# EAGLE design 50_Shot_CPU_V0.0 (EAGLE 7.7.0)
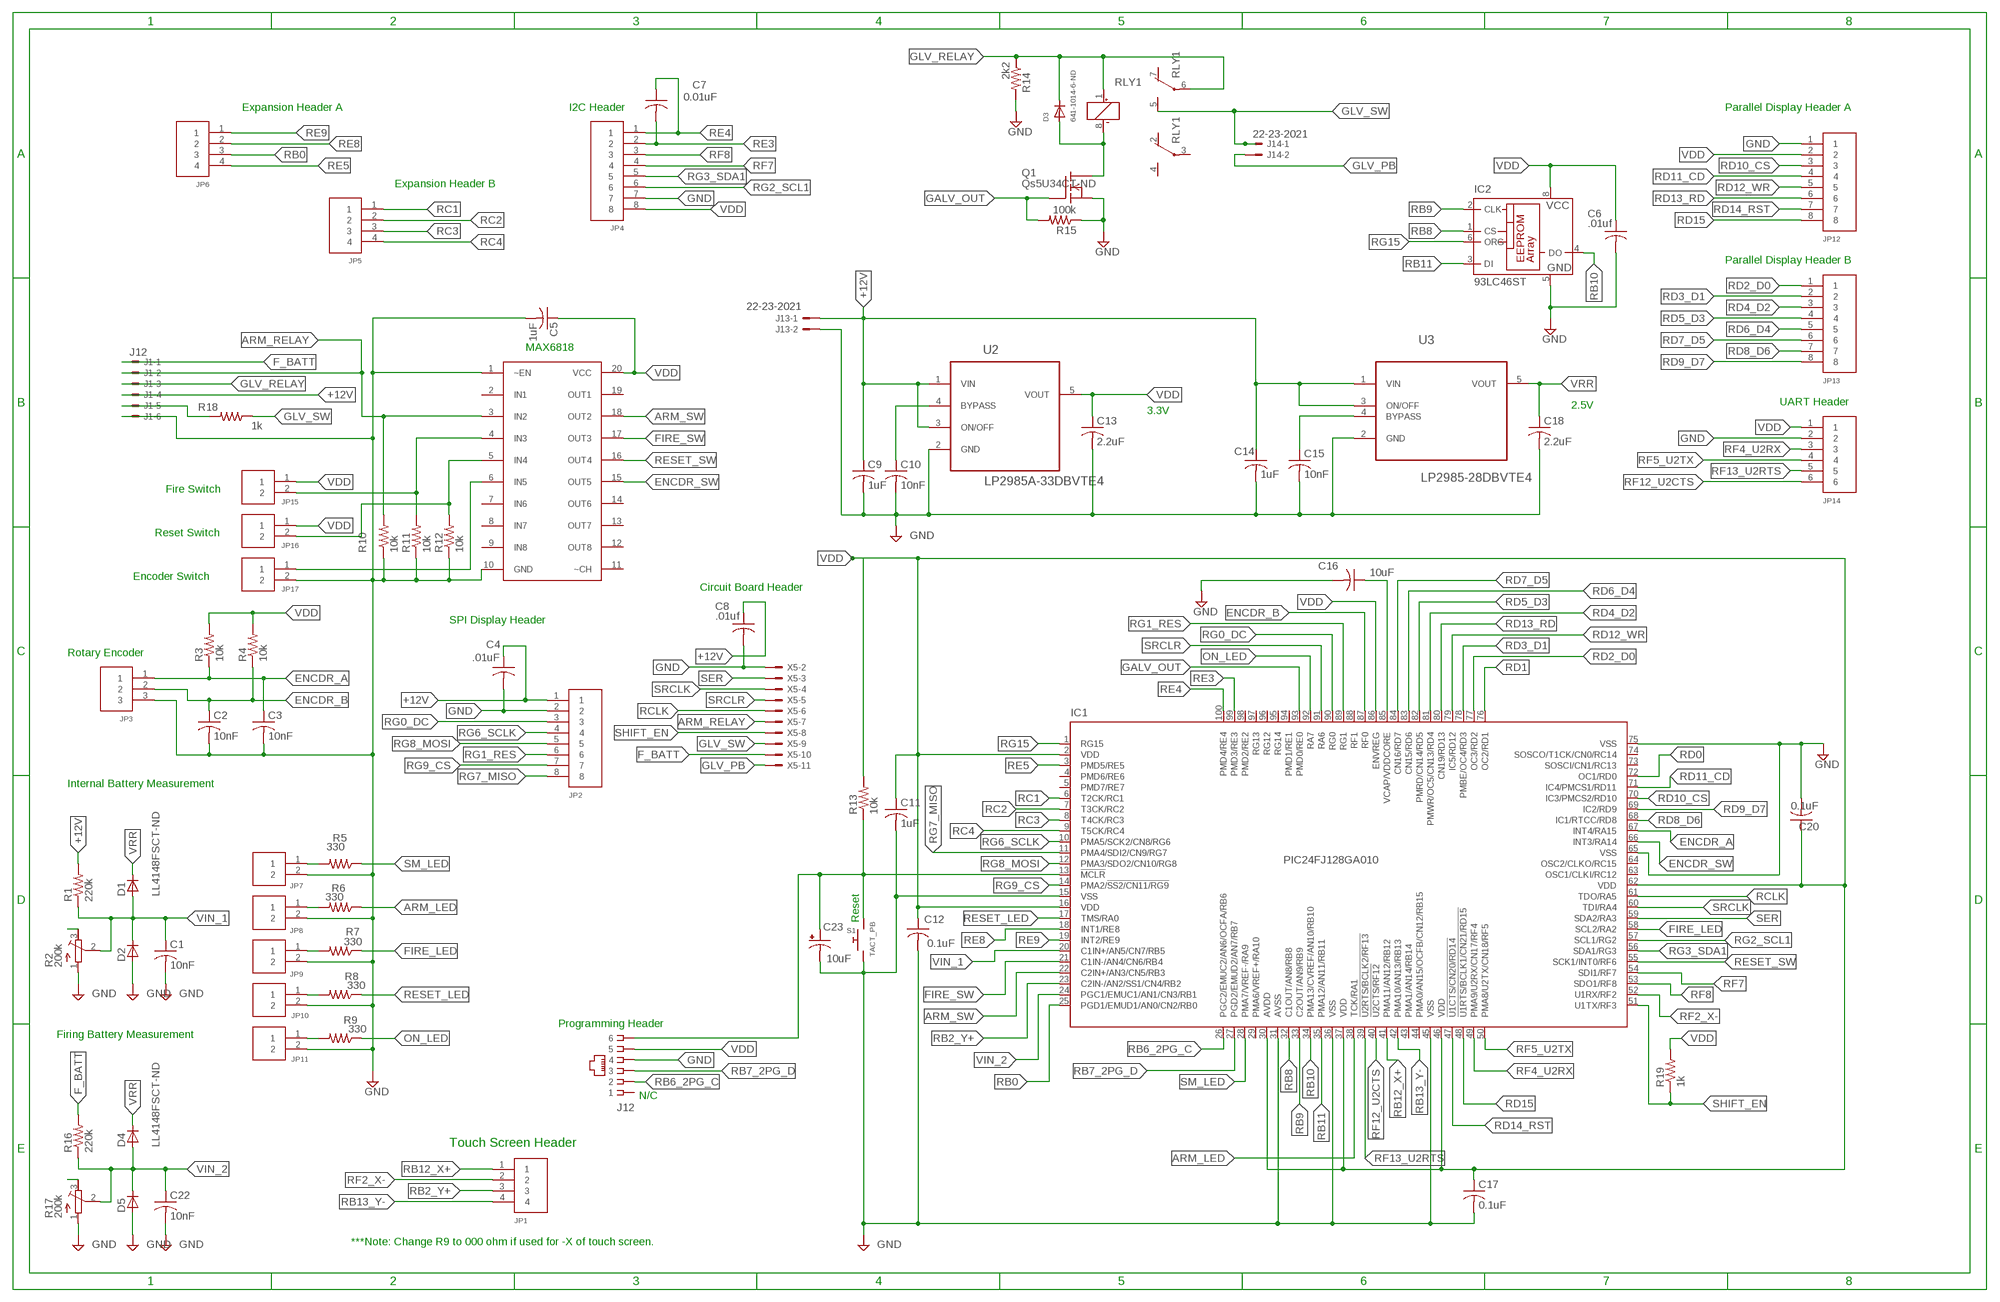
[diagram p0: schematic, sheet 1]

## Parts
C1  10nF  C-USC0805  [C0805]
C2  10nF  C-USC0805  [C0805]
C3  10nF  C-USC0805  [C0805]
C4  .01uF  C-USC0805  [C0805]
C5  1uF  C-USC0805  [C0805]
C6  .01uf  C-USC0805  [C0805]
C7  0.01uF  C-USC0805  [C0805]
C8  .01uf  C-USC0805  [C0805]
C9  1uF  C-USC0805  [C0805]
C10  10nF  C-USC0805  [C0805]
C11  1uF  C-USC0805  [C0805]
C12  0.1uF  C-USC0805  [C0805]
C13  2.2uF  C-USC0805  [C0805]
C14  1uF  C-USC0805  [C0805]
C15  10nF  C-USC0805  [C0805]
C16  10uF  C-USC0805  [C0805]
C17  0.1uF  C-USC0805  [C0805]
C18  2.2uF  C-USC0805  [C0805]
C20  0.1uF  C-USC0805  [C0805]
C22  10nF  C-USC0805  [C0805]
C23  10uF  CAP3X3  [CAP3X3]
D1  LL4148FSCT-ND  D-SOD-80  [SOD80]
D2  LL4148FSCT-ND  D-SOD-80  [SOD80]
D3  641-1014-6-ND  DIODESOD-123  [SOD-123]
D4  LL4148FSCT-ND  D-SOD-80  [SOD80]
D5  LL4148FSCT-ND  D-SOD-80  [SOD80]
IC1  PIC24FJ128GA010  [TQFP100-14X14]
IC2  93LC46ST  [TSSOP8]
J1  J12  22-23-2061  [22-23-2061]
J12  A311422_nd  RJ_25  [RJ11-NO_SHIELD]
J13  22-23-2021  [22-23-2021]
J14  22-23-2021  [22-23-2021]
JP1  SHERLOCK_4PIN_RGT  [SHERLOCK_4PIN_RGT]
JP2  SHERLOCK_8PIN_RGT  [SHERLOCK_8PIN-RGT]
JP3  SHERLOCK_3PIN_RGT  [SHERLOCK_3PIN_RGT]
JP4  SHERLOCK_8PIN_RGT  [SHERLOCK_8PIN-RGT]
JP5  SHERLOCK_4PIN_RGT  [SHERLOCK_4PIN_RGT]
JP6  SHERLOCK_4PIN_RGT  [SHERLOCK_4PIN_RGT]
JP7  SHERLOCK_2PIN_RGT  [SHERLOCK_2PIN_RGT]
JP8  SHERLOCK_2PIN_RGT  [SHERLOCK_2PIN_RGT]
JP9  SHERLOCK_2PIN_RGT  [SHERLOCK_2PIN_RGT]
JP10  SHERLOCK_2PIN_RGT  [SHERLOCK_2PIN_RGT]
JP11  SHERLOCK_2PIN_RGT  [SHERLOCK_2PIN_RGT]
JP12  SHERLOCK_8PIN_RGT  [SHERLOCK_8PIN-RGT]
JP13  SHERLOCK_8PIN_RGT  [SHERLOCK_8PIN-RGT]
JP14  SHERLOCK_6PIN_RGT  [SHERLOCK_6PIN_RGT]
JP15  SHERLOCK_2PIN_RGT  [SHERLOCK_2PIN_RGT]
JP16  SHERLOCK_2PIN_RGT  [SHERLOCK_2PIN_RGT]
JP17  SHERLOCK_2PIN_RGT  [SHERLOCK_2PIN_RGT]
Q1  Qs5U34CT-ND  QS5U34CT-ND_MOSFET_N_CHANNEL  [SOT23-5L]
R1  220k  R-US_M0805  [M0805]
R2  200k  R-TRIMM3224X  [RTRIM3224X]
R3  10k  R-US_M0805  [M0805]
R4  10k  R-US_M0805  [M0805]
R5  330  R-US_M0805  [M0805]
R6  330  R-US_M0805  [M0805]
R7  330  R-US_M0805  [M0805]
R8  330  R-US_M0805  [M0805]
R9  330  R-US_M0805  [M0805]
R10  10k  R-US_M0805  [M0805]
R11  10k  R-US_M0805  [M0805]
R12  10k  R-US_M0805  [M0805]
R13  10k  R-US_M0805  [M0805]
R14  2k2  R-US_M0805  [M0805]
R15  100k  R-US_M0805  [M0805]
R16  220k  R-US_M0805  [M0805]
R17  200k  R-TRIMM3224X  [RTRIM3224X]
R18  1k  R-US_M0805  [M0805]
R19  1k  R-US_M0805  [M0805]
RLY1  OMRON  [OMRONG6S]
S1  TACT_PB  [PUSHBUTTON_SMD_SJ]
U1  MAX6818  [SSOP20]
U2  LP2985A-33DBVTE4  [SOT95P280X145-5N]
U3  LP2985-28DBVTE4  [SOT95P280X145-5N]
X5  22-23-2111  [22-23-2111]

## Nets
+12V: C4.1 C8.1 C9.1 C14.1 J1.4 J13.1 JP2.1 R1.2 U2.1(VIN) U2.3(ON/OFF) U3.1(VIN) U3.3(ON/OFF)
ARM_LED: IC1.38(TCK/RA1) R6.1
ARM_RELAY: J1.2 R10.2 U1.3(IN2) X5.7
ARM_SW: IC1.22(C2IN+/AN3/CN5/RB3) U1.18(OUT2)
ENCDR_A: C3.1 IC1.67(INT4/RA15) JP3.1 R3.1
ENCDR_B: C2.1 IC1.87(RF0) JP3.2 R4.1
ENCDR_SW: IC1.66(INT3/RA14) U1.15(OUT5)
F_BATT: J1.1 R16.2 X5.10
FIRE_LED: IC1.58(SCL2/RA2) R7.1
FIRE_SW: IC1.21(C1IN-/AN4/CN6/RB4) U1.17(OUT3)
GALV_OUT: IC1.93(PMD0/RE0) Q1.1(G) R15.2
GLV_PB: J14.2 X5.11
GLV_RELAY: D3.C J1.3 R14.1 RLY1.1(1:+) RLY1.6(2:P)
GLV_SW: J14.1 R18.1 RLY1.5(2:S) X5.9
GND: C1.2 C2.2 C3.2 C4.2 C5.2 C6.2 C8.2 C9.2 C10.2 C11.2 C12.2 C13.2 C14.2 C15.2 C16.2 C17.2 C18.2 C20.2 C22.2 C23.- D2.2(A) D5.2(A) IC1.15(VSS) IC1.31(AVSS) IC1.36(VSS) IC1.45(VSS) IC1.65(VSS) IC1.75(VSS) IC2.5(GND) J1.6 J12.4 J13.2 JP2.2 JP3.3 JP4.7 JP7.2 JP8.2 JP9.2 JP10.2 JP11.2 JP12.1 JP14.2 JP17.2 Q1.2(S) R2.1(A) R10.1 R11.1 R12.1 R14.2 R15.1 R17.1(A) S1.1 S1.2 U1.1(~EN) U1.10(GND) U2.2(GND) U3.2(GND) X5.2
MCLR: C23.+ IC1.13(!MCLR) J12.6 R13.1 S1.3 S1.4
N$1: D3.A Q1.5(D) RLY1.8(1:-)
N$2: JP7.1 R5.2
N$3: C10.1 U2.4(BYPASS)
N$4: C16.1 IC1.85(VCAP/VDDCORE)
N$5: R2.3(E)
N$6: JP8.1 R6.2
N$7: JP17.1 U1.6(IN5)
N$8: JP16.2 R12.2 U1.5(IN4)
N$9: JP9.1 R7.2
N$10: R17.3(E)
N$11: J1.5 R18.2
N$12: JP10.1 R8.2
N$13: JP11.1 R9.2
N$55: C15.1 U3.4(BYPASS)
N$58: JP15.2 R11.2 U1.4(IN3)
ON_LED: IC1.92(RA7) R9.1
RB0: IC1.25(PGD1/EMUD1/AN0/CN2/RB0) JP6.3
RB2_Y+: IC1.23(C2IN-/AN2/SS1/CN4/RB2) JP1.3
RB6_2PG_C: IC1.26(PGC2/EMUC2/AN6/OCFA/RB6) J12.2
RB7_2PG_D: IC1.27(PGD2/EMUD2/AN7/RB7) J12.3
RB8: IC1.32(C1OUT/AN8/RB8) IC2.1(CS)
RB9: IC1.33(C2OUT/AN9/RB9) IC2.2(CLK)
RB10: IC1.34(PMA13/CVREF/AN10/RB10) IC2.4(DO)
RB11: IC1.35(PMA12/AN11/RB11) IC2.3(DI)
RB12_X+: IC1.41(PMA11/AN12/RB12) JP1.1
RB13_Y-: IC1.42(PMA10/AN13/RB13) JP1.4
RC1: IC1.6(T2CK/RC1) JP5.1
RC2: IC1.7(T3CK/RC2) JP5.2
RC3: IC1.8(T4CK/RC3) JP5.3
RC4: IC1.9(T5CK/RC4) JP5.4
RCLK: IC1.61(TDO/RA5) X5.6
RD0: IC1.72(OC1/RD0)
RD1: IC1.76(OC2/RD1)
RD2_D0: IC1.77(OC3/RD2) JP13.1
RD3_D1: IC1.78(PMBE/OC4/RD3) JP13.2
RD4_D2: IC1.81(PMWR/OC5/CN13/RD4) JP13.3
RD5_D3: IC1.82(PMRD/CN14/RD5) JP13.4
RD6_D4: IC1.83(CN15/RD6) JP13.5
RD7_D5: IC1.84(CN16/RD7) JP13.6
RD8_D6: IC1.68(IC1/RTCC/RD8) JP13.7
RD9_D7: IC1.69(IC2/RD9) JP13.8
RD10_CS: IC1.70(IC3/PMCS2/RD10) JP12.3
RD11_CD: IC1.71(IC4/PMCS1/RD11) JP12.4
RD12_WR: IC1.79(IC5/RD12) JP12.5
RD13_RD: IC1.80(CN19/RD13) JP12.6
RD14_RST: IC1.47(!U1CTS/CN20/RD14) JP12.7
RD15: IC1.48(!U1RTS/BCLK1/CN21/RD15) JP12.8
RE3: C7.2 IC1.99(PMD3/RE3) JP4.2
RE4: C7.1 IC1.100(PMD4/RE4) JP4.1
RE5: IC1.3(PMD5/RE5) JP6.4
RE8: IC1.18(INT1/RE8) JP6.2
RE9: IC1.19(INT2/RE9) JP6.1
RESET_LED: IC1.17(TMS/RA0) R8.1
RESET_SW: IC1.55(SCK1/INT0/RF6) U1.16(OUT4)
RF2_X-: IC1.52(U1RX/RF2) JP1.2
RF4_U2RX: IC1.49(PMA9/U2RX/CN17/RF4) JP14.3
RF5_U2TX: IC1.50(PMA8/U2TX/CN18/RF5) JP14.4
RF7: IC1.54(SDI1/RF7) JP4.4
RF8: IC1.53(SDO1/RF8) JP4.3
RF12_U2CTS: IC1.40(!U2CTS/RF12) JP14.6
RF13_U2RTS: IC1.39(!U2RTS/BCLK2/RF13) JP14.5
RG0_DC: IC1.90(RG0) JP2.3
RG1_RES: IC1.89(RG1) JP2.6
RG2_SCL1: IC1.57(SCL1/RG2) JP4.6
RG3_SDA1: IC1.56(SDA1/RG3) JP4.5
RG6_SCLK: IC1.10(PMA5/SCK2/CN8/RG6) JP2.4
RG7_MISO: IC1.11(PMA4/SDI2/CN9/RG7) JP2.8
RG8_MOSI: IC1.12(PMA3/SDO2/CN10/RG8) JP2.5
RG9_CS: IC1.14(PMA2/!SS2/CN11/RG9) JP2.7
RG15: IC1.1(RG15) IC2.6(ORG)
SER: IC1.59(SDA2/RA3) X5.3
SHIFT_EN: IC1.51(U1TX/RF3) R19.1 X5.8
SM_LED: IC1.28(PMA7/VREF-/RA9) R5.1
SRCLK: IC1.60(TDI/RA4) X5.4
SRCLR: IC1.91(RA6) X5.5
VDD: C5.1 C6.1 C11.1 C12.1 C13.1 C17.1 C20.1 IC1.2(VDD) IC1.16(VDD) IC1.30(AVDD) IC1.37(VDD) IC1.46(VDD) IC1.62(VDD) IC1.86(ENVREG) IC2.8(VCC) J12.5 JP4.8 JP12.2 JP14.1 JP15.1 JP16.1 R3.2 R4.2 R13.2 R19.2 U1.20(VCC) U2.5(VOUT)
VIN_1: C1.1 D1.2(A) D2.1(C) IC1.20(C1IN+/AN5/CN7/RB5) R1.1 R2.2(S)
VIN_2: C22.1 D4.2(A) D5.1(C) IC1.24(PGC1/EMUC1/AN1/CN3/RB1) R16.1 R17.2(S)
VRR: C18.1 D1.1(C) D4.1(C) U3.5(VOUT)
Unconnected: IC1.4(PMD6/RE6) IC1.5(PMD7/RE7) IC1.29(PMA6/VREF+/RA10) IC1.43(PMA1/AN14/RB14) IC1.44(PMA0/AN15/OCFB/CN12/RB15) IC1.63(OSC1/CLKI/RC12) IC1.64(OSC2/CLKO/RC15) IC1.73(SOSCI/CN1/RC13) IC1.74(SOSCO/T1CK/CN0/RC14) IC1.88(RF1) IC1.94(PMD1/RE1) IC1.95(RG14) IC1.96(RG12) IC1.97(RG13) IC1.98(PMD2/RE2) IC2.7(NU) J12.1 RLY1.2(3:O) RLY1.3(3:P) RLY1.4(3:S) RLY1.7(2:O) U1.2(IN1) U1.7(IN6) U1.8(IN7) U1.9(IN8) U1.11(~CH) U1.12(OUT8) U1.13(OUT7) U1.14(OUT6) U1.19(OUT1) X5.1

## Notes on the sheet
- Expansion Header A | I2C Header | Parallel Display Header A
- Expansion Header B
- Parallel Display Header B
- MAX6818
- UART Header
- 2.5V
- 3.3V
- Fire Switch
- Reset Switch
- Encoder Switch
- Circuit Board Header
- SPI Display Header
- Rotary Encoder
- Internal Battery Measurement
- Reset
- Programming Header
- Firing Battery Measurement
- N/C
- Touch Screen Header
- ***Note: Change R9 to 000 ohm if used for -X of touch screen.

## Library data of the parts
C1-C18 C20 C22 = rcl:C-US: CAPACITOR, American symbol
C23 = Mine:CAP3X3: capacitor - electrolytic This is from the Nichicon 3mm series
D1 D2 D4 D5 = semicon-smd-ipc:D-: DIODE unfilled
D3 = adafruit:DIODE: Diode SMADIODE - SMA Surface Mount Package 20V 1A Schottky Diode Digikey: 641-1014-6-ND DO-1N4148 - Through Hole Small Current Diode SOD-123 20V 1 A (.5mV Vf) Schottky Diode - Digikey: MBRX120TPMSCT-ND SOD-323 10V 570mA (.38mV Vf, 3ns) Schottky Diode - Digikey: ZLLS410CT-ND SOD-523 30V 30mA Schottky Diode (RB751S-40TE61) - Digikey: RB751S-40TE61CT-ND SOT23-R/W - SOT23 Package (R = Solder Paste/Reflow Ovens, W = Hand-Soldering) BAT54Film 40V 300mA - Digikey: 497-7162-1-ND
IC1 = microchip:PIC24FJ*GA010: 64/80/100-Pin General Purpose, 16-Bit Flash Microcontrollers Source: http://ww1.microchip.com/downloads/en/DeviceDoc/39747d.pdf; MPN: PIC24FJ128GA010-I/PT; OC_FARNELL: 1146522; OC_NEWARK: 56K7341
IC2 = microchip:93*: Serial EPROM 1 K/2 K/4 K, low voltage, Microwire; MF: MICROCHIP; MPN: 93LC46C-I/ST; OC_FARNELL: 1817225; OC_NEWARK: 30H4716
J1 = Mine:22-23-2061: .100" (2.54mm) Center Header - 6 Pin; MF: MOLEX; MPN: 22-23-2061; OC_FARNELL: 1462922; OC_NEWARK: 27C1933
J12 = Mine:RJ_25: RJ_25 Package: RJ_25 through hole Digikey Part # A311422-ND
J13 J14 = Mine:22-23-2021: .100" (2.54mm) Center Header - 2 Pin; MF: MOLEX; MPN: 22-23-2021; OC_FARNELL: 1462926; OC_NEWARK: 25C3832
JP1 JP5 JP6 = Mine:SHERLOCK_4PIN_RGT: 2mm Pitch
JP2 JP4 JP12 JP13 = Mine:SHERLOCK_8PIN_RGT: 2mm Pitch
JP3 = Mine:SHERLOCK_3PIN_RGT: 2mm Pitch
JP7-JP11 JP15-JP17 = Mine:SHERLOCK_2PIN_RGT: 2mm Pitch
JP14 = Mine:SHERLOCK_6PIN_RGT: 2mm Pitch
Q1 = Mine:QS5U34CT-ND_MOSFET_N_CHANNEL: QS5U34CT-ND Enhancement mode, N-channel MOSFET Package: SOT 23-5
R1 R3-R12 R14-R16 R18 = rcl:R-US_: RESISTOR, American symbol
R2 R17 = rcl:R-TRIMM: Trimm resistor
R13 R19 = rcl-2:R-US_: RESISTOR, American symbol
RLY1 = Mine:OMRON: Low Signal Relay oeiwcsnts1.omron.com/.. D20G6K0100.pdf Package: Omron G6S-2F series
S1 = Mine:TACT_PB: Surfacemount tactile push button 6mm body Digikeyn part£:n CKN9085ct-nd
U1 = Mine:MAX6818: MAX6818 Octal Debouncer package 20SSOP Digikey part#: MAX6818EAP+TCT-ND
U2 = Texas Instruments_By_element14_Batch_1:LP2985A-33DBVTE4: 150-mA LOW-NOISE LOW-DROPOUT REGULATOR WITH SHUTDOWN; MPN: LP2985A-33DBVTE4; OC_FARNELL: 1053660; OC_NEWARK: 79K3928; PACKAGE: SOT-23-5; SUPPLIER: Texas Instruments
U3 = Texas Instruments_By_element14_Batch_1:LP2985-28DBVTE4: LOW-NOISE LOW-DROPOUT REGULATOR WITH SHUTDOWN; MPN: LP2985-28DBVTE4; OC_FARNELL: 1053676; OC_NEWARK: 97K3681; PACKAGE: SOT-23-5; SUPPLIER: Texas Instruments
X5 = con-molex:22-23-2111: .100" (2.54mm) Center Header - 11 Pin; MF: MOLEX; MPN: 22-23-2111; OC_FARNELL: 5388879; OC_NEWARK: 27C9916

## Net classes
0 default: width 0.254 mm, drill 0.508 mm, clearance 0.203 mm

## Board
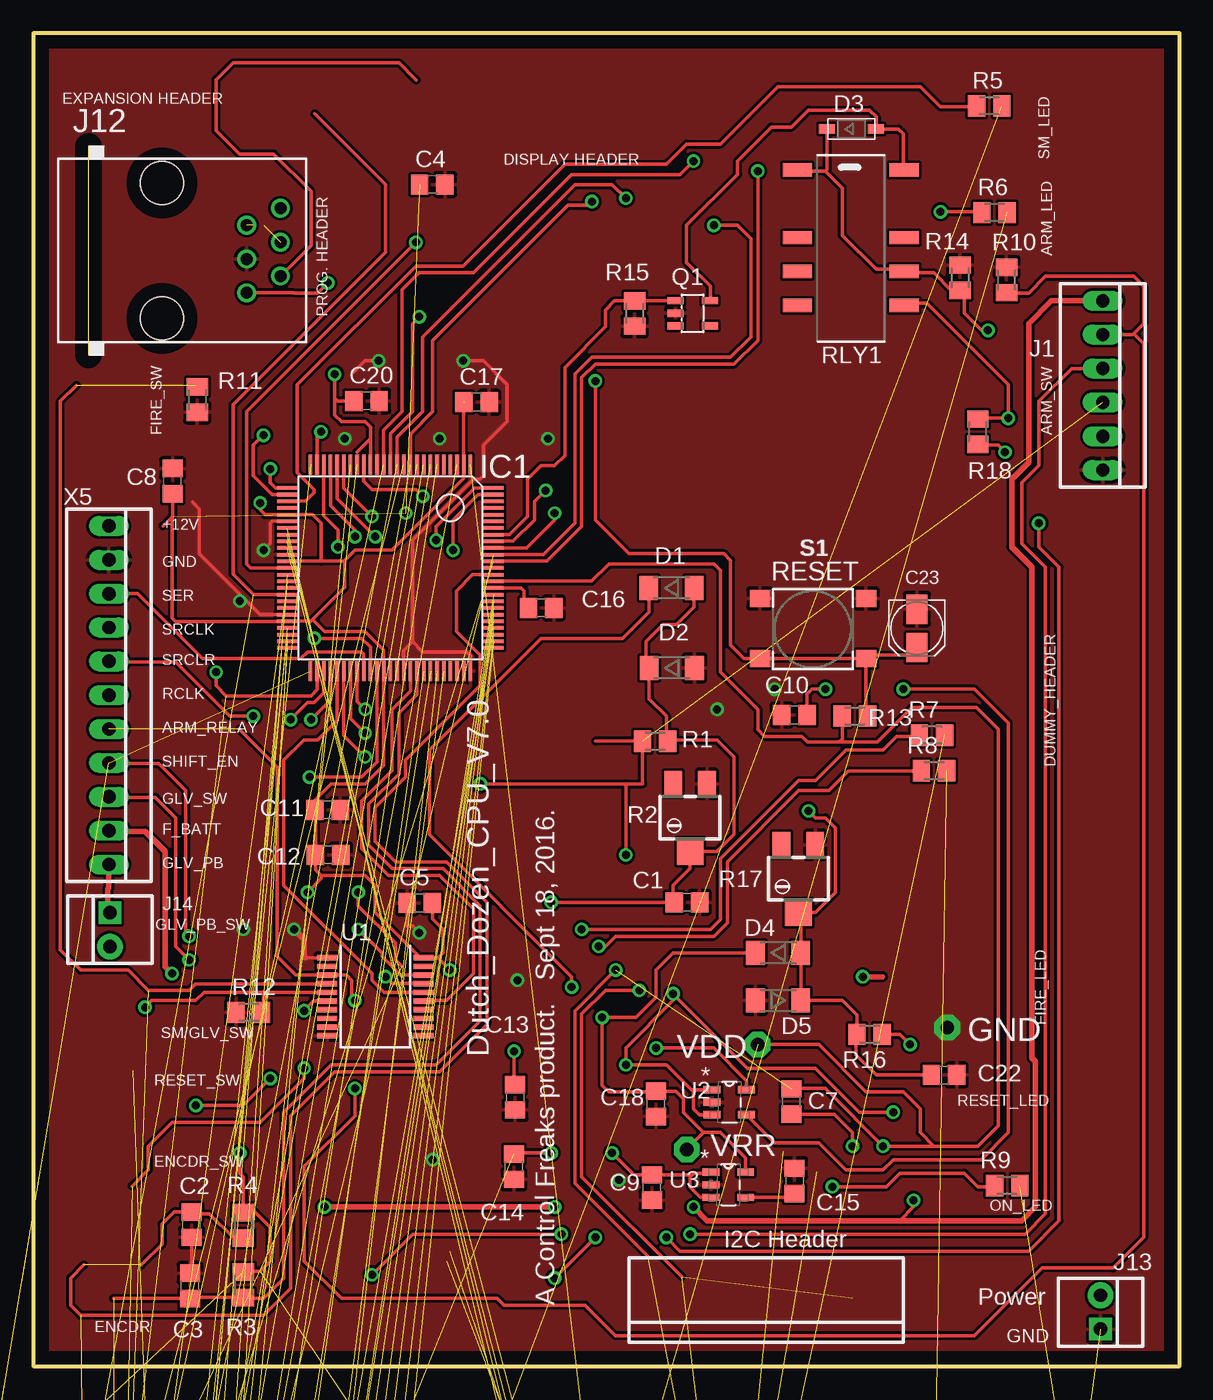
[diagram p1: board, top side]
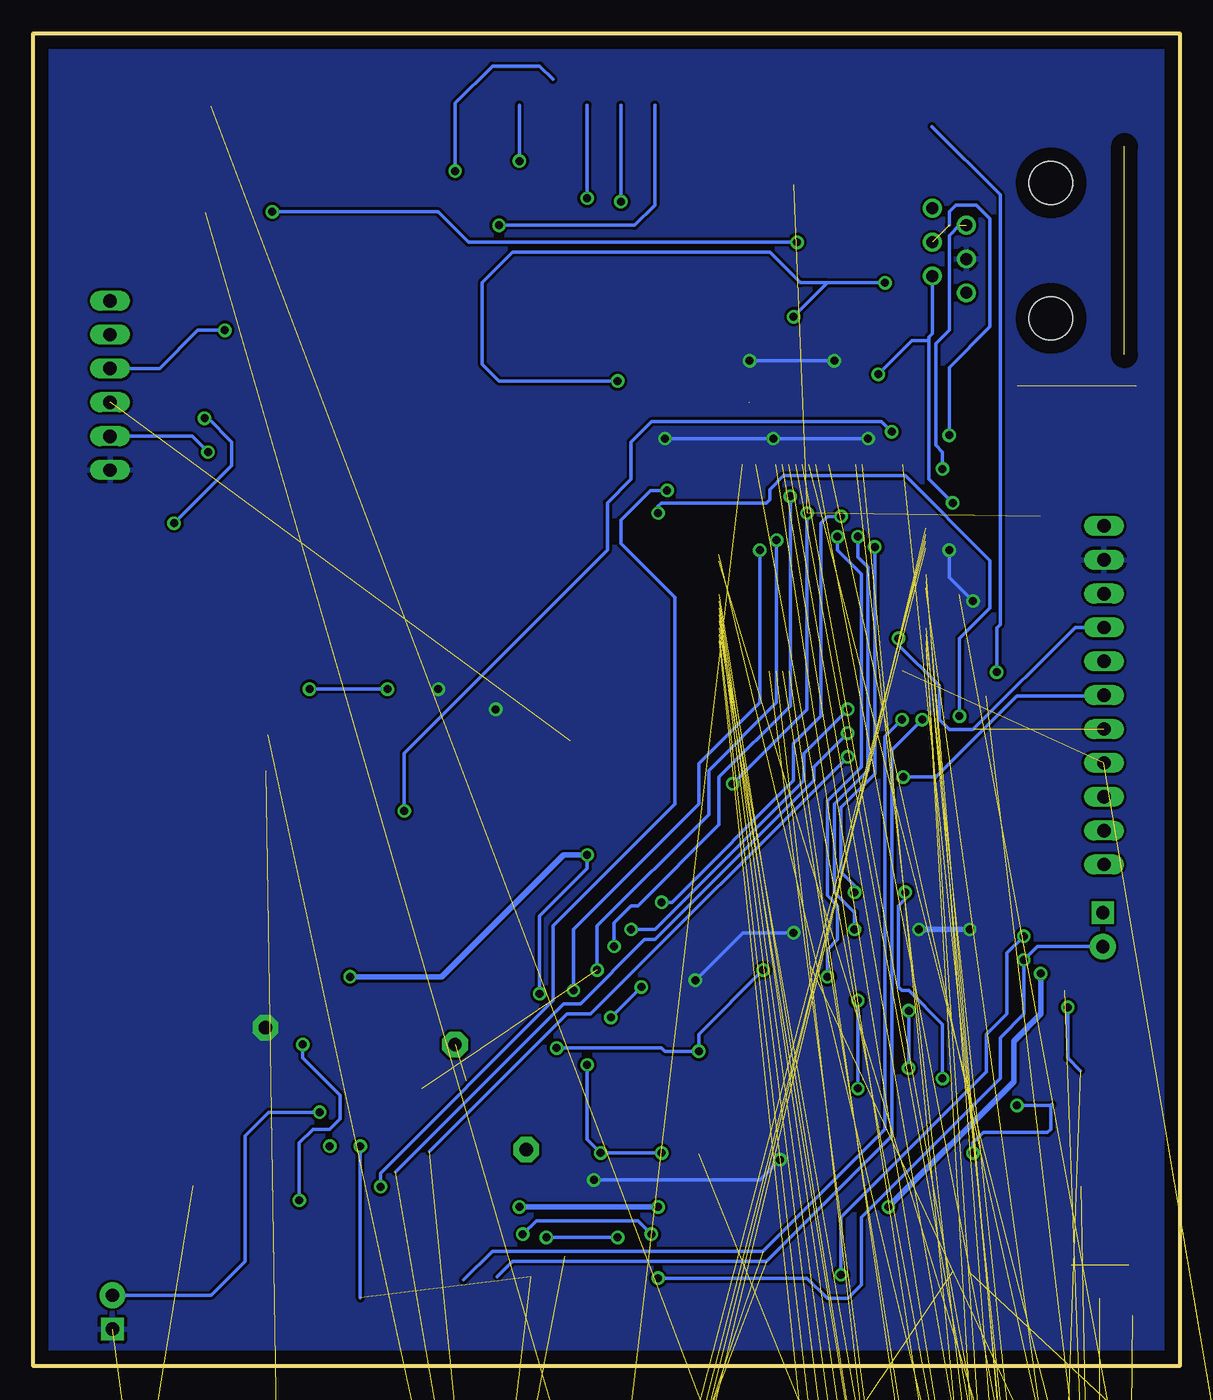
[diagram p2: board, bottom side, seen from below]

Size 86 x 100 mm. Coordinates in mm from the lower left corner, seen from the top.
Outline: 0,0 86,0 86,100 0,100 0,0
Copper layers (1*16): Top 0.035mm / dielectric 1.5mm / Bottom 0.035mm
Design rules "default *": minimum track width 8mil, minimum drill 20mil, track to track 8mil, track to pad 8mil, pad to pad 8mil, via to via 8mil, smd to smd 8mil, copper to edge 40mil, drill to drill 8mil, minimum pad ring 10mil, minimum via ring 8mil, stop-mask expansion 4mil, vias tented up to drill 0mil, thermal gap 10mil

### Footprints (pad centres in the part's own frame; a part is rotated, then mirrored left to right if it is on the bottom)
C0805 = smd 1.3 x 1.5: 1 -0.95,0; 2 0.95,0
CAP3X3 = smd 2.2 x 1.6: + 1.45,0; - -1.425,0
SOD80 = smd 1.4 x 1.8: 1 -1.7,0; 2 1.7,0
SOD-123 = smd 1.2 x 0.7: A 1.85,0; C -1.85,0
TQFP100-14X14 = smd 0.27 x 1.5: 1 -6,-7.75; 2 -5.5,-7.75; 3 -5,-7.75; 4 -4.5,-7.75; 5 -4,-7.75; 6 -3.5,-7.75; 7 -3,-7.75; 8 -2.5,-7.75; 9 -2,-7.75; 10 -1.5,-7.75; 11 -1,-7.75; 12 -0.5,-7.75; 13 0,-7.75; 14 0.5,-7.75; 15 1,-7.75; 16 1.5,-7.75; 17 2,-7.75; 18 2.5,-7.75; 19 3,-7.75; 20 3.5,-7.75; 21 4,-7.75; 22 4.5,-7.75; 23 5,-7.75; 24 5.5,-7.75; 25 6,-7.75; 51 6,7.75; 52 5.5,7.75; 53 5,7.75; 54 4.5,7.75; 55 4,7.75; 56 3.5,7.75; 57 3,7.75; 58 2.5,7.75; 59 2,7.75; 60 1.5,7.75; 61 1,7.75; 62 0.5,7.75; 63 0,7.75; 64 -0.5,7.75; 65 -1,7.75; 66 -1.5,7.75; 67 -2,7.75; 68 -2.5,7.75; 69 -3,7.75; 70 -3.5,7.75; 71 -4,7.75; 72 -4.5,7.75; 73 -5,7.75; 74 -5.5,7.75; 75 -6,7.75 | smd 1.5 x 0.27: 26 7.75,-6; 27 7.75,-5.5; 28 7.75,-5; 29 7.75,-4.5; 30 7.75,-4; 31 7.75,-3.5; 32 7.75,-3; 33 7.75,-2.5; 34 7.75,-2; 35 7.75,-1.5; 36 7.75,-1; 37 7.75,-0.5; 38 7.75,0; 39 7.75,0.5; 40 7.75,1; 41 7.75,1.5; 42 7.75,2; 43 7.75,2.5; 44 7.75,3; 45 7.75,3.5; 46 7.75,4; 47 7.75,4.5; 48 7.75,5; 49 7.75,5.5; 50 7.75,6; 76 -7.75,6; 77 -7.75,5.5; 78 -7.75,5; 79 -7.75,4.5; 80 -7.75,4; 81 -7.75,3.5; 82 -7.75,3; 83 -7.75,2.5; 84 -7.75,2; 85 -7.75,1.5; 86 -7.75,1; 87 -7.75,0.5; 88 -7.75,0; 89 -7.75,-0.5; 90 -7.75,-1; 91 -7.75,-1.5; 92 -7.75,-2; 93 -7.75,-2.5; 94 -7.75,-3; 95 -7.75,-3.5; 96 -7.75,-4; 97 -7.75,-4.5; 98 -7.75,-5; 99 -7.75,-5.5; 100 -7.75,-6
TSSOP8 = smd 0.35 x 1.2: 1 -0.975,-2.925; 2 -0.325,-2.925; 3 0.325,-2.925; 4 0.975,-2.925; 5 0.975,2.925; 6 0.325,2.925; 7 -0.325,2.925; 8 -0.975,2.925
22-23-2061 = drill 1 long: 1 -6.35,0; 2 -3.81,0; 3 -1.27,0; 4 1.27,0; 5 3.81,0; 6 6.35,0
RJ11-NO_SHIELD = drill 0.9 pad 1.4: 1 -3.175,8.89; 2 -1.905,6.35; 3 -0.635,8.89; 4 0.635,6.35; 5 1.905,8.89; 6 3.175,6.35 | hole 3.251: -5.08,0; 5.08,0
22-23-2021 = drill 1 pad 1.93: 1 -1.27,0 | drill 1 pad 1.676 square: 2 1.27,0
SHERLOCK_4PIN_RGT = drill 0.813 square: 1 3,0 | drill 0.813: 2 1,0; 3 -1,0; 4 -3,0
SHERLOCK_8PIN-RGT = drill 0.813 square: 1 7,0 | drill 0.813: 2 5,0; 3 3,0; 4 1,0; 5 -1,0; 6 -3,0; 7 -5,0; 8 -7,0
SHERLOCK_3PIN_RGT = drill 0.813 square: 1 2,0 | drill 0.813: 2 0,0; 3 -2,0
SHERLOCK_2PIN_RGT = drill 0.813 square: 1 2,0 | drill 0.813: 2 0,0
SHERLOCK_6PIN_RGT = drill 0.813 square: 1 5,0 | drill 0.813: 2 3,0; 3 1,0; 4 -1,0; 5 -3,0; 6 -5,0
SOT23-5L = smd 0.55 x 1.2: 1 -0.95,-1.3; 2 0,-1.3; 3 0.95,-1.3; 4 0.95,1.3; 5 -0.95,1.3
M0805 = smd 1.3 x 1.6: 1 -0.95,0; 2 0.95,0
RTRIM3224X = smd 1.32 x 1.9: 1 -1.27,-2.54; 3 1.27,-2.54 | smd 2 x 2: 2 0,2.54
OMRONG6S = smd 1 x 2.2: 1 -3.2,-5.825; 2 1.88,-5.825; 3 4.42,-5.825; 4 6.96,-5.825; 5 6.96,2.175; 6 4.42,2.175; 7 1.88,2.175; 8 -3.2,2.175
PUSHBUTTON_SMD_SJ = smd 1.55 x 1.3: 1 -3.865,2.205; 2 4.085,2.205; 3 -3.865,-2.295; 4 4.085,-2.295
SSOP20 = smd 0.4 x 1.5: 1 -2.925,-3.625; 2 -2.275,-3.625; 3 -1.625,-3.625; 4 -0.975,-3.625; 5 -0.325,-3.625; 6 0.325,-3.625; 7 0.975,-3.625; 8 1.625,-3.625; 9 2.275,-3.625; 10 2.925,-3.625; 11 2.925,3.625; 12 2.275,3.625; 13 1.625,3.625; 14 0.975,3.625; 15 0.325,3.625; 16 -0.325,3.625; 17 -0.975,3.625; 18 -1.625,3.625; 19 -2.275,3.625; 20 -2.925,3.625
SOT95P280X145-5N = smd 1.27 x 0.559: 1 -1.295,0.94; 2 -1.295,0; 3 -1.295,-0.94; 4 1.295,-0.94; 5 1.295,0.94
22-23-2111 = drill 1 long: 1 -12.7,0; 2 -10.16,0; 3 -7.62,0; 4 -5.08,0; 5 -2.54,0; 6 0,0; 7 2.54,0; 8 5.08,0; 9 7.62,0; 10 10.16,0; 11 12.7,0

### Placement (x,y rotation side)
C1  49.04,34.8 0 top
C2  11.87,10.62 270 top
C3  11.76,6.03 90 top
C4  29.94,88.65 0 top
C5  28.99,34.76 180 top
C6  50.04,-35.56 0 top  (outside the outline)
C7  56.87,19.85 270 top
C8  10.45,66.41 90 top
C9  46.41,13.41 270 top
C10  57.11,48.86 180 top
C11  22.08,41.74 0 top
C12  22.12,38.37 0 top
C13  36.16,20.18 270 top
C14  36.05,14.97 270 top
C15  57.12,13.9 90 top
C16  38.1,56.9 0 top
C17  33.26,72.33 0 top
C18  46.71,19.68 270 top
C20  24.99,72.42 0 top
C22  68.33,21.84 0 top
C23  66.29,55.37 270 top
D1  47.88,58.39 0 top
D2  47.91,52.39 0 top
D3  61.38,92.82 0 top
D4  55.88,30.99 0 top
D5  55.88,27.43 180 top
IC1  26.79,59.89 180 top
IC2  44.2,-34.8 0 top  (outside the outline)
J1  80.24,73.58 270 top
J12  9.65,83.7 270 top
J13  80.07,4.05 270 top
J14  5.75,32.74 90 top
JP1  5.08,-20.57 0 top  (outside the outline)
JP2  8.89,-33.78 0 top  (outside the outline)
JP3  4.06,-46.99 0 top  (outside the outline)
JP4  50.55,-51.31 0 top  (outside the outline)
JP5  5.08,-77.47 0 top  (outside the outline)
JP6  5.08,-92.71 0 top  (outside the outline)
JP7  27.69,-19.05 0 top  (outside the outline)
JP8  40.64,-18.29 0 top  (outside the outline)
JP9  52.32,-17.78 0 top  (outside the outline)
JP10  65.53,-18.29 0 top  (outside the outline)
JP11  77.22,-18.54 0 top  (outside the outline)
JP12  8.89,-107.95 0 top  (outside the outline)
JP13  8.89,-123.19 0 top  (outside the outline)
JP14  7.11,-136.4 0 top  (outside the outline)
JP15  2.03,-151.64 0 top  (outside the outline)
JP16  13.72,-151.38 0 top  (outside the outline)
JP17  2.03,-166.88 0 top  (outside the outline)
Q1  49.47,78.99 270 top
R1  46.66,46.9 180 top
R2  49.28,41.15 180 top
R3  15.76,6.1 90 top
R4  15.75,10.57 90 top
R5  71.72,94.55 0 top
R6  72.12,86.55 0 top
R7  67.44,47.35 0 top
R8  67.59,44.66 0 top
R9  73.07,13.55 0 top
R10  73.02,81.49 270 top
R11  12.3,72.52 90 top
R12  16.16,26.54 0 top
R13  61.64,48.78 180 top
R14  69.53,81.66 90 top
R15  45.11,78.98 90 top
R16  62.74,24.89 0 top
R17  57.4,36.58 180 top
R18  70.87,70.1 270 top
R19  -2.54,-9.14 0 top  (outside the outline)
RLY1  63.16,86.55 270 top
S1  58.39,55.39 0 top
U1  25.66,27.72 270 top
U2  52.22,19.8 0 top
U3  52.15,13.61 0 top
X5  5.67,50.34 270 top

### Tracks (layer width: path | path; a pad name or v marks a point on that pad's centre or on a via)
+12V  (via drill 0.6)  (4 unrouted)
  Top 0.254: v33.53,43.69 44.45,43.69 | 44.45,43.69 45.72,43.69 R1.2 42.19,46.9 | v38.86,16 36.13,16 C14.1 | U3.1 50.79,14.48 49.53,14.48 49.28,14.22 | 49.28,14.22 49.28,13.46 50.07,12.67 U3.3 | 50.8,20.87 U2.1 49.53,20.74 | v44.45,38.35 44.45,43.69 | 49.53,20.74 49.36,20.74 47.5,22.61 v44.45,22.61 44.45,23.88 48.01,27.43 v48.01,27.94 53.59,22.35 58.67,22.35 61.98,19.05 v64.52,19.05 | U2.3 49.97,18.86 49.53,19.3 49.53,20.74 | 49.28,14.22 49.28,14.36 C9.1 45.08,14.36 v43.43,16 | C8.1 10.45,63.75 9.74,63.04
  Top 0.406: 63.71,29.21 v62.23,29.21
  Bottom 0.254: v27.94,64.01 27.94,49.28 v33.53,43.69 | J13.1 80.06,5.33 72.64,5.33 70.1,7.87 70.1,17.27 68.33,19.05 v64.52,19.05 | v38.86,16 v43.43,16 44.45,17.02 v44.45,22.61 | v48.01,27.94 48.01,33.78 44.45,37.34 v44.45,38.35
  Bottom 0.406: v44.45,38.35 46.23,38.35 55.37,29.21 v62.23,29.21
ARM_LED  (via drill 0.6)
  Top 0.254: IC1.38 16.31,59.89 16,60.2 16,71.63 v28.7,84.33 | v68.07,86.61 71.11,86.61 R6.1
  Bottom 0.254: v28.7,84.33 53.34,84.33 55.63,86.61 v68.07,86.61
ARM_RELAY  (via drill 0.6)  (1 unrouted)
  Top 0.254: 15.45,47.8 18.29,44.96 18.29,30.73 19.68,29.34 U1.3 | 20.95,29.34 U1.3 | 82.55,77.47 82.47,77.39 J1.2 | R10.2 73.05,80.52 | 73.05,80.52 73.15,80.42 | 73.05,80.52 74.68,80.52 75.95,81.79 82.55,81.79 83.31,81.03 83.31,78.23 82.55,77.47 | 82.55,77.47 83.31,76.71 83.31,9.65 81.03,7.37 75.69,7.37 70.61,2.29 43.69,2.29 41.4,4.57 35.31,4.57 34.8,5.08 23.11,5.08 20.32,7.87 20.32,14.99 24.13,18.8 v24.13,20.83 | U1.3 23.49,29.34 23.88,28.96 23.88,27.69 v24.13,27.43
  Bottom 0.254: v24.13,20.83 v24.13,27.43
ARM_SW  (via drill 0.6)
  Top 0.254: IC1.22 22.29,64.58 24.13,62.74 v24.13,62.23 | v24.38,32.77 26.16,30.99 26.16,30.73 27.55,29.34 U1.18
  Bottom 0.254: v24.13,62.23 24.13,60.71 23.37,59.94 23.37,44.7 25.91,42.16 25.91,35.56 24.38,34.04 v24.38,32.77
ENCDR_A  (1 unrouted)
  Top 0.254: IC1.67 28.79,50.38 27.43,49.02 27.43,44.45 25.15,42.16 25.15,39.12 26.92,37.34 30.73,37.34 33.53,34.54 33.53,25.91 30.23,22.61 22.35,22.61 18.8,19.05 18.8,6.6 17.27,5.08 15.83,5.08 R3.1 11.83,5.15 C3.1 6.03,5.08
ENCDR_B  (2 unrouted)
  Top 0.254: IC1.87 32.97,59.39 31.75,58.17 31.75,55.12 33.53,53.34 33.53,51.05 27.94,45.47 27.94,44.2 25.65,41.91 25.65,39.37 27.18,37.85 30.99,37.85 34.04,34.8 34.04,25.65 30.48,22.1 22.61,22.1 19.3,18.8 19.3,5.84 17.27,3.81 3.56,3.81 2.79,4.57 2.79,6.6 3.79,7.6 | 8.11,7.6 9.65,9.14 9.65,10.67 10.56,11.57 C2.1 12.01,11.43 13.21,11.43 15.02,9.62 R4.1
ENCDR_SW
  Top 0.254: U1.15 29.33,27.43 30.99,27.43 33.02,29.46 33.02,34.29 30.48,36.83 26.67,36.83 24.64,38.86 24.64,42.42 26.92,44.7 26.92,49.28 28.29,50.64 IC1.66
F_BATT  (via drill 0.6)
  Top 0.254: X5.10 5.72,40.13 | R16.2 65.02,24.89 v65.79,24.13 | v66.04,12.45 66.04,11.94 65.02,10.92
  Top 0.406: 5.72,40.13 8.38,40.13 9.91,38.61 9.91,29.97 v10.41,29.46 | J1.1 76.38,79.93 74.68,78.23 74.68,67.82 73.41,66.55 73.41,61.47 74.93,59.94 74.93,23.11 75.18,22.86 75.18,11.94 74.17,10.92 65.02,10.92 50.55,10.92 v49.53,11.94 | v21.84,11.94 v39.12,11.94
  Bottom 0.254: v65.79,24.13 65.79,23.11 62.99,20.32 62.99,18.54 63.75,17.78 65.02,17.78 66.04,16.76 v66.04,12.45
  Bottom 0.406: v49.53,11.94 v39.12,11.94 | v10.41,29.46 10.41,26.42 12.45,24.38 12.45,21.34 v21.84,11.94
FIRE_LED  (via drill 0.6)
  Top 0.254: IC1.58 24.29,49.88 v24.89,49.28 | v41.15,32.77 50.8,32.77 51.56,33.53 51.56,38.1 57.4,43.94 58.67,43.94 60.96,46.23 63.75,46.23 64.77,47.24 66.38,47.24 R7.1
  Bottom 0.254: v24.89,49.28 28.19,45.97 28.19,43.94 39.37,32.77 v41.15,32.77
FIRE_SW  (via drill 0.6)
  Top 0.254: IC1.21 22.79,65.09 v25.65,62.23 | U1.17 29.29,28.7 26.92,28.7 v26.42,29.21
  Top 0.305: 29.26,28.67 U1.17
  Bottom 0.254: v25.65,62.23 25.65,61.21 23.88,59.44 23.88,44.96 26.42,42.42 26.42,35.31 25.65,34.54 25.65,32 26.42,31.24 v26.42,29.21
GALV_OUT
  Top 0.254: IC1.93 35.72,62.39 37.08,63.75 37.08,66.55 38.1,67.56 39.12,67.56 39.88,68.33 39.88,74.93 42.93,77.98 42.93,79.25 43.61,79.93 R15.2 | 44.96,80.09 R15.2 | R15.2 Q1.1
GLV_PB
  Top 0.406: X5.11 5.67,35.9 5.59,35.81 5.59,34.18 J14.2
GLV_RELAY  (via drill 0.6)
  Top 0.254: 5.72,45.21 9.4,45.21 11.43,43.18 11.43,32.51 v11.68,32.26 | v49.28,9.91 74.42,9.91 75.95,11.43 75.95,59.94 74.17,61.72 74.17,66.29 75.44,67.56 75.44,72.39 77.9,74.85 J1.3 | v39.62,9.91 28.45,9.91 v25.4,6.86 | v71.63,77.72 71.12,77.72 69.85,78.99 69.85,80.39 R14.1 68.89,80.71 67.56,82.04 65.42,82.04 RLY1.6 65.17,82.3 63.25,82.3 60.71,84.84 60.71,88.39 59.44,89.66 | 59.44,89.66 57.42,89.66 RLY1.1 | D3.C 59.53,89.76 59.44,89.66
  Bottom 0.254: v11.68,32.26 12.95,30.99 12.95,26.42 14.48,24.89 14.48,22.1 25.4,11.18 v25.4,6.86 | v49.28,9.91 48.26,10.92 40.64,10.92 v39.62,9.91 | v71.63,77.72 73.66,77.72 76.53,74.85 J1.3
GLV_SW  (via drill 0.6)
  Top 0.254: X5.9 5.72,42.67 9.14,42.67 10.67,41.15 10.67,31.5 v11.68,30.48 | v42.16,9.65 v39.12,6.6 | v47.5,9.65 48.51,8.64 74.68,8.64 76.96,10.92 76.96,59.94 75.44,61.47 v75.44,63.25 | RLY1.5 65.5,79.76 67.06,79.76 73.15,73.66 v73.15,71.12 70.93,71.12 R18.1
  Bottom 0.254: J14.1 5.78,31.5 10.67,31.5 v11.68,30.48 11.68,26.42 13.46,24.64 13.46,21.59 23.88,11.18 23.88,6.1 24.89,5.08 26.42,5.08 27.94,6.6 v39.12,6.6 | v47.5,9.65 v42.16,9.65 | v75.44,63.25 71.12,67.56 71.12,69.34 72.9,71.12 v73.15,71.12
GND  (via drill 0.6, 1 pad 1.93)  (13 unrouted)
  Top 0.254: 25.79,72.27 C20.2 | C5.2 28.04,33.12 27.94,33.02 28.45,33.02 v28.96,32.51 | C3.2 11.87,6.98 C2.2 | U1.1 20.41,30.64 | 32.77,52.16 IC1.75 32.79,53.32 32.51,53.59 29.21,53.59 28.45,54.36 | 28.45,54.36 27.79,53.7 IC1.65 | v32.26,75.44 33.78,75.44 35.56,73.66 35.56,70.87 33.78,69.09 33.78,66.8 33.53,66.55 33.02,66.55 28.45,61.98 28.45,54.36 | v25.91,75.44 24.89,75.44 24.04,74.59 | IC1.45 17.02,56.39 12.45,60.96 12.45,64.31 11.94,64.82 | IC1.31 17.92,63.39 17.78,63.25 17.78,61.72 v17.27,61.21
  Top 0.406: 20.41,30.64 20.32,30.73 20.32,32 v19.56,32.77
  Bottom 0.254: v30.48,69.6 v23.37,69.6 v38.61,69.6 | v43.94,13.97 31.5,13.97 v29.97,15.49 | v28.96,32.51 32.77,32.51 v36.32,28.96 | v32.26,75.44 v25.91,75.44 | v17.27,61.21 17.27,59.18 v15.49,57.4
  Bottom 0.406: v19.56,32.77 v15.75,32.77
  other vias: 51.31,49.28 55.63,50.8 68.58,25.4
  pour Top: -0.51,101.09 86.87,101.09 86.87,98.81 86.87,-0.76 -0.76,-0.76 -0.76,3.81 -0.76,24.89 -0.76,45.97 -0.76,66.8 -0.76,86.11 -0.76,101.09
  pour Bottom: 0.51,99.31 85.34,99.31 85.34,96.27 85.34,23.11 85.34,1.02 0.51,1.02 0.51,2.79 0.51,55.37 0.51,97.28
MCLR  (via drill 0.6)
  Top 0.254: IC1.13 26.79,69.97 28.45,71.63 28.45,78.23 v28.96,78.74 | v22.1,81.28 21.34,80.52 19.56,80.52 19.55,80.53 J12.6 | S1.4 S1.3 53.33,53.09 52.32,54.1 52.32,60.45 51.82,60.96 44.7,60.96 42.16,63.5 v42.16,73.91 | S1.4 62.72,53.34 66.29,53.34 C23.+ | S1.4 62.48,48.9 R13.1
  Bottom 0.254: 26.42,81.28 v22.1,81.28 | v28.96,78.74 26.42,81.28 | 26.42,81.28 28.45,81.28 30.73,83.57 50.04,83.57 52.32,81.28 52.32,75.18 51.05,73.91 v42.16,73.91
N$1
  Top 0.254: Q1.5 50.84,80.01 50.8,80.05 50.8,81.03 49.02,82.8 49.02,85.6 52.83,89.41 52.83,90.42 55.37,92.96 56.9,92.96 58.17,94.23 62.74,94.23 63.25,93.73 63.25,92.84 D3.A 64.91,92.82 65.28,92.46 65.28,89.81 RLY1.8
N$2  (1 unrouted)
N$3  (via drill 0.6)
  Top 0.254: U2.4 55.62,16.76 58.93,16.76 60.96,14.73 63.75,14.73 64.52,15.49 71.12,15.49 73.15,17.53 73.15,48.26 70.61,50.8 v65.28,50.8 | v59.44,50.8 58.42,50.8 58.06,50.44 C10.1
  Bottom 0.254: v59.44,50.8 v65.28,50.8
N$4
  Top 0.254: IC1.85 36.61,58.39 36.83,58.17 36.83,57.22 C16.1
N$6  (1 unrouted)
N$7  (via drill 0.6)  (1 unrouted)
  Top 0.254: U1.6 21.04,27.39 v20.32,26.67 | v20.32,22.35 20.32,21.59 17.02,18.29 10.41,18.29 8.64,16.51 8.64,14.73 7.41,13.5
  Bottom 0.254: v20.32,26.67 v20.32,22.35
N$8  (via drill 0.6)  (1 unrouted)
  Top 0.254: U1.5 17.27,28.04 | 17.27,28.04 12.8,28.04 12.19,27.43 8.89,27.43 v8.38,26.92 | R12.2 17.27,26.71 17.27,28.04
  Bottom 0.254: v8.38,26.92 8.38,23.11 7.44,22.17
N$9  (1 unrouted)
N$11  (via drill 0.6)
  Top 0.254: R18.2 70.93,69.09 72.39,69.09 v72.9,68.58
  Bottom 0.254: v72.9,68.58 74.09,69.77 J1.5
N$12  (1 unrouted)
N$13  (1 unrouted)
N$55
  Top 0.254: U3.4 56.84,12.67 C15.1
N$58  (2 unrouted)
  Top 0.254: U1.4 12.18,28.69 11.68,28.19 8.64,28.19 7.11,29.72 3.56,29.72 2.03,31.24 2.03,72.39 3.23,73.58 | 12.18,73.58 R11.2
ON_LED  (via drill 0.6)
  Top 0.254: IC1.92 35.98,61.89 37.59,63.5 37.59,64.85 v38.44,65.7 | 72.12,13.46 R9.1 72.03,13.46 70.87,13.46 69.85,14.48 65.02,14.48 64.01,13.46 v59.94,13.46
  Bottom 0.254: v38.44,65.7 39.71,65.7 41.91,63.5 41.91,61.72 37.85,57.66 37.85,42.16 46.99,33.02 46.99,27.43 59.94,14.48 v59.94,13.46
RB0  (1 unrouted)
RB2_Y+  (via drill 0.6)  (1 unrouted)
  Top 0.254: IC1.23 21.79,63.81 22.86,62.74 v22.86,61.47 | v24.38,35.56 24.38,34.54 27.18,31.75 27.18,30.48 27.67,29.99
  Bottom 0.254: v24.38,35.56 24.38,36.07 25.4,37.08 25.4,41.91 22.86,44.45 v22.86,61.47
RB6_2PG_C  (via drill 0.6)  (1 unrouted)
  Top 0.254: IC1.26 18.18,65.89 17.78,66.29 v17.78,67.31
  Bottom 0.254: v17.78,67.31 17.78,68.58 18.29,69.09 18.29,76.71 17.27,77.72 17.27,84.84 16.5,85.61
RB7_2PG_D  (via drill 0.6)  (1 unrouted)
  Top 0.254: IC1.27 17.92,65.39 16.51,66.8 16.51,69.09 v17.27,69.85 17.02,69.6
  Bottom 0.254: v17.27,69.85 17.27,74.93 14.22,77.98 14.22,86.11 15.24,87.12 16.76,87.12 17.27,86.61 17.27,85.61
RB8  (1 unrouted)
RB9  (1 unrouted)
RB10  (1 unrouted)
RB11  (1 unrouted)
RB12_X+  (1 unrouted)
RB13_Y-  (1 unrouted)
  Top 0.254: IC1.42 16.53,57.89 14.99,59.44 14.99,72.14 26.42,83.57 26.42,88.65 21.11,93.95
RC1  (1 unrouted)
RC2  (1 unrouted)
RC3  (1 unrouted)
RC4  (1 unrouted)
RCLK  (via drill 0.6)
  Top 0.254: IC1.61 25.79,45.35 24.64,44.2 v20.73,44.2
  Bottom 0.254: X5.6 5.72,50.29 12.19,50.29 18.29,44.2 v20.73,44.2
RD2_D0  (1 unrouted)
RD3_D1  (1 unrouted)
RD4_D2  (1 unrouted)
RD5_D3  (1 unrouted)
RD6_D4  (1 unrouted)
RD7_D5  (1 unrouted)
RD8_D6  (1 unrouted)
RD9_D7  (1 unrouted)
RD10_CS  (1 unrouted)
RD11_CD  (1 unrouted)
RD12_WR  (1 unrouted)
RD13_RD  (1 unrouted)
RD14_RST  (1 unrouted)
RD15  (1 unrouted)
RE3  (via drill 0.6)  (2 unrouted)
  Top 0.254: IC1.99 33.39,65.39 31.5,63.5 v31.5,61.21 | 48.65,6.72 41.15,14.22 41.15,26.42 42.93,28.19 v45.47,28.19 | C7.2 60.09,18.9 61.47,17.53 v61.47,16.51
  Bottom 0.254: v31.5,61.21 31.5,49.78 36.07,45.21 36.07,42.16 45.47,32.77 v45.47,28.19 | 61.47,5.12 v61.47,16.51
RE4  (via drill 0.6)  (2 unrouted)
  Top 0.254: IC1.100 33.12,65.89 30.23,62.99 v30.23,61.98 | 46.11,8.25 40.64,13.72 40.64,26.67 v43.69,29.72
  Bottom 0.254: v30.23,61.98 30.23,49.78 35.31,44.7 35.31,41.4 43.69,33.02 v43.69,29.72
RE5  (1 unrouted)
RE8  (1 unrouted)
RE9  (1 unrouted)
RESET_LED  (via drill 0.6)
  Top 0.254: IC1.17 24.79,66.4 25.4,65.79 28.7,65.79 v29.21,65.28 | v42.42,31.5 42.93,31.5 43.69,32.26 51.05,32.26 52.07,33.27 52.07,37.85 57.4,43.18 59.69,43.18 61.17,44.66 R8.1
  Bottom 0.254: v29.21,65.28 29.21,49.53 34.54,44.2 34.54,40.64 40.64,34.54 41.15,34.54 42.42,33.27 v42.42,31.5
RESET_SW
  Top 0.254: IC1.55 22.79,48.44 21.34,46.99 20.32,46.99 18.8,45.47 18.8,36.07 25.4,29.46 25.4,28.96 26.32,28.04 U1.16
RF2_X-  (via drill 0.6)  (1 unrouted)
  Top 0.254: IC1.52 21.29,50.75 20.83,50.29 14.48,50.29 13.72,51.05 v13.72,52.07
  Bottom 0.254: 18.57,92.99 13.46,87.88 13.46,55.63 13.72,55.37 v13.72,52.07
RF4_U2RX  (1 unrouted)
RF5_U2TX  (1 unrouted)
RF7  (via drill 0.6)  (1 unrouted)
  Top 0.254: IC1.54 22.29,49.98 v20.83,48.51
  Bottom 0.254: v20.83,48.51 22.1,47.24 22.1,17.78 31.24,8.64 51.56,8.64 53.73,6.47
RF8  (via drill 0.6)  (1 unrouted)
  Top 0.254: IC1.53 21.79,50.49 21.08,49.78 20.57,49.78 v19.3,48.51
  Bottom 0.254: v19.3,48.51 21.59,46.23 21.59,17.27 30.99,7.87 50.04,7.87 51.19,6.72
RF12_U2CTS  (1 unrouted)
RF13_U2RTS  (1 unrouted)
RG0_DC  (via drill 0.6)  (1 unrouted)
  Top 0.254: IC1.90 38.28,60.89 40.64,63.25 40.64,74.42 41.91,75.69 52.32,75.69 53.85,77.22 53.85,84.58 52.83,85.6 v51.05,85.6
  Bottom 0.254: 39.37,94.62 39.37,87.12 40.89,85.6 v51.05,85.6
RG1_RES  (via drill 0.6)  (1 unrouted)
  Top 0.254: IC1.89 38.55,60.39 41.15,62.99 41.15,74.17 42.16,75.18 52.58,75.18 54.36,76.96 v54.36,89.66
  Bottom 0.254: v54.36,89.66 54.36,94.74 51.56,97.54 48.01,97.54 47.01,96.54
RG2_SCL1  (via drill 0.6)  (1 unrouted)
  Top 0.254: IC1.57 23.79,48.6 v24.89,47.5
  Bottom 0.254: v24.89,47.5 27.43,44.96 27.43,43.94 39.37,32 40.13,32 44.96,27.18 46.23,27.18 58.81,14.6
RG3_SDA1  (via drill 0.6)  (1 unrouted)
  Top 0.254: IC1.56 23.29,47.32 v24.89,45.72
  Bottom 0.254: 56.27,16.12 45.97,26.42 44.2,26.42 v24.89,45.72
RG6_SCLK  (via drill 0.6)  (1 unrouted)
  Top 0.254: IC1.10 28.29,69.95 29.97,71.63 29.97,76.96 40.13,87.12 41.66,87.12 v41.91,87.38
  Bottom 0.254: v41.91,87.38 41.91,94.62
RG7_MISO  (1 unrouted)
RG8_MOSI  (via drill 0.6)  (1 unrouted)
  Top 0.254: v44.45,87.63 43.43,88.65 40.64,88.65 29.21,77.22 29.21,71.63 27.29,69.71 IC1.12
  Bottom 0.254: v44.45,87.63 44.45,94.62
RG9_CS  (via drill 0.6)  (1 unrouted)
  Top 0.254: IC1.14 26.29,70.23 27.69,71.63 27.69,80.77 28.96,82.04 33.02,82.04 40.39,89.41 48.51,89.41 v49.53,90.42
  Bottom 0.254: v49.53,90.42 49.53,94.62
RG15  (1 unrouted)
SER
  Top 0.254: IC1.59 24.79,53.44 24.64,53.59 20.57,53.59 20.07,53.09 12.7,53.09 7.83,57.96 X5.3
SHIFT_EN  (2 unrouted)
SM_LED
  Top 0.254: IC1.28 20.44,64.89 21.08,65.53 21.08,65.79 19.81,67.06 19.81,73.66 28.7,82.55 32.26,82.55 39.88,90.17 47.5,90.17 49.02,91.69 51.56,91.69 55.88,96.01 66.55,96.01 68.07,94.49 70.71,94.49 R5.1
SRCLK  (via drill 0.6)
  Top 0.254: v21.08,54.61 24.64,54.61 25.29,53.96 IC1.60
  Bottom 0.254: v21.08,54.61 21.08,54.1 18.03,51.05 18.03,48.51 17.27,47.75 15.49,47.75 7.83,55.42 X5.4
SRCLR  (via drill 0.6)
  Top 0.254: IC1.91 37.01,61.39 39.12,63.5 v39.12,64.01 | v16.51,48.77 14.73,48.77 10.67,52.83 5.72,52.83 X5.5
  Bottom 0.254: v39.12,64.01 39.12,64.52 38.86,64.77 30.99,64.77 30.73,65.02 30.73,65.79 29.72,66.8 20.57,66.8 14.22,60.45 14.22,56.9 16.51,54.61 v16.51,48.77
VDD  (via drill 0.6, 1 pad 1.93)  (10 unrouted)
  Top 0.254: 21.59,36.83 21.17,37.25 C12.1 21.17,41.7 C11.1 21.13,42.47 22.35,43.69 24.89,43.69 26.29,45.09 IC1.62 26.29,53.72 24.89,55.12 21.84,55.12 20.95,56.01 | 21.59,36.83 24.89,36.83 25.65,36.07 25.65,34.04 29.05,30.64 U1.20 30.39,30.64 | 23.37,60.45 24.13,61.21 26.92,61.21 32.29,66.58 IC1.2 32.29,72.31 | 23.37,60.45 23.31,60.39 21.59,60.39 | 21.59,60.39 IC1.37 | 21.59,60.39 21.59,63.25 20.95,63.89 IC1.30 17.39,63.89 17.02,64.26 v17.02,64.77 | 20.95,56.01 20.84,55.89 IC1.46 10.67,55.88 10.41,56.13 10.41,63.75 10.45,63.79 | 20.95,56.01 23.37,58.42 23.37,60.45 | IC1.16 25.29,69.6 | 25.29,69.6 25.29,70.47 24.89,70.87 23.11,70.87 22.61,71.37 22.61,72.64 | 22.61,72.64 v22.61,74.42 | J12.5 20.83,84.08 20.83,88.14 18.03,90.93 15.49,90.93 13.72,92.71 13.72,96.52 14.99,97.79 27.43,97.79 28.73,96.49 | 21.59,36.83 21.59,36.58 v20.57,35.56 | v17.78,21.59 15.75,19.56 v12.19,19.56 | v15.49,16 15.49,14.48 15.75,14.22 R4.2 16.67,11.52 17.78,10.41 17.78,7.87 17.02,7.11 15.82,7.11 R3.2 | 56.89,20.83 59.44,20.83 v63.75,16.51 67.56,16.51 | 53.58,20.8 U2.5 53.52,21.41 51.05,23.88 v46.74,23.88 | 30.39,30.64 30.73,30.99 30.73,32.77 29.94,33.56 C5.1 | 30.39,30.64 31.24,29.79 v31.24,29.72 | v36.07,23.62 36.07,21.59 36.16,21.5 C13.1 | 67.56,16.51 70.87,16.51 72.39,18.03 72.39,47.75 70.74,49.4 65.91,49.4 63.33,46.82 60.45,46.82 | C20.1 22.83,72.42 22.61,72.64 | IC1.86 41.87,58.89 43.18,60.2 51.05,60.2 51.56,59.69 51.56,52.07 54.36,49.28 54.36,47.75 54.86,47.24 57.66,47.24 58.08,46.82 60.45,46.82 | 24.29,68.6 25.29,69.6 | 60.71,48.77 R13.2 60.69,47.06 60.45,46.82 | v54.36,24.13 58.93,24.13 62.48,20.57 65.28,20.57 66.55,19.3 66.55,17.53 67.56,16.51
  Bottom 0.254: 18.8,76.96 18.8,77.22 18.54,77.47 J12.5 | 18.8,76.96 18.8,66.55 v17.02,64.77 | v22.61,74.42 20.07,76.96 18.8,76.96 | v15.49,16 15.49,16.76 14.73,17.53 9.91,17.53 9.65,17.78 9.65,19.56 | 63.89,16.37 v63.75,16.51 | v12.19,19.56 9.65,19.56 | 9.65,19.56 9.58,19.63 | v31.24,29.72 36.07,24.89 v36.07,23.62 38.61,23.62 38.86,23.88 v46.74,23.88 | v20.57,35.56 20.57,35.05 21.08,34.54 21.08,28.45 20.83,28.19 20.32,28.19 17.78,25.65 v17.78,21.59
VIN_1  (via drill 0.6)
  Top 0.254: D1.2 49.58,56.95 48.26,55.63 47.24,55.63 45.97,54.36 45.97,52.63 D2.1 46.21,50.06 47.5,48.77 47.5,47.01 R1.1 47.7,46.99 51.31,46.99 52.58,45.72 52.58,39.88 51.31,38.61 R2.2 49.28,37.34 48.01,36.07 48.01,34.88 C1.1 v38.86,34.8 | IC1.20 23.29,65.86 v25.4,63.75
  Bottom 0.254: v25.4,63.75 26.42,63.75 26.92,63.25 26.92,48.77 28.96,46.74 28.96,43.94 38.1,34.8 v38.86,34.8
VIN_2  (via drill 0.6)
  Top 0.254: IC1.24 21.29,69.8 v21.59,70.1 | v58.17,41.66 58.67,41.15 59.44,41.15 60.2,40.39 60.2,35.56 58.67,34.04 R17.2 57.58,33.86 D4.2 D5.1 60.71,27.43 61.79,26.35 R16.1 61.72,24.83 61.72,23.37 63.25,21.84 C22.1
  Bottom 0.254: v21.59,70.1 22.35,70.87 39.62,70.87 41.15,69.34 41.15,66.55 42.93,64.77 42.93,61.21 58.17,45.97 v58.17,41.66
VRR  (via drill 0.6, 1 pad 1.93)
  Top 0.254: U3.5 53.45,15.64 51.56,17.53 50.29,17.53 | 50.29,17.53 48.77,19.05 48.77,20.07 48.2,20.63 C18.1 | D1.1 46.18,56.59 44.2,54.61 38.1,54.61 29.72,46.23 29.72,39.88 40.39,29.21 v40.39,28.45 | 46.74,20.65 C18.1 | C18.1 46.66,20.57 43.18,20.57 42.67,21.08 v42.67,26.16 45.21,26.16 46.74,27.69 46.74,29.72 48.01,30.99 D4.1 | 50.29,17.53 v49.02,16.26
  Bottom 0.254: v40.39,28.45 v42.67,26.16

### Text on the board
tPlace: +12V trace on pin 1 of CPU Header 16mil. | EXPANSION HEADER | SM_LED | DISPLAY HEADER | ARM_LED | PROG. HEADER | FIRE_SW | ARM_SW | +12V | GND | RESET | SER | SRCLK | SRCLR | RCLK | Dutch_Dozen_CPU_V7.0 | ARM_RELAY | SHIFT_EN | DUMMY_HEADER | GLV_SW | F_BATT | GLV_PB | GLV_PB_SW | FIRE_LED | SM/GLV_SW | GND | VDD | RESET_SW | RESET_LED | ENCDR_SW | VRR | ON_LED | I2C Header | A Control Freaks product. Sept 18, 2016. | Power | ENCDR | GND | SM_LED | ARM_ / LED | FIRE_ / LED | RST_ / LED | ON_ / LED | Touch | SPI Display Header | Rotary / Encoder | I2C Header | Expansion / B | Expansion / A | Parallel A | Parallel B | UART | Fire_ / SW | RST_ / SW